# EAGLE schematic axiom_beta_interface_cmv12000_v0.3 (EAGLE 7.0.0)

## Sheet 1 of 2
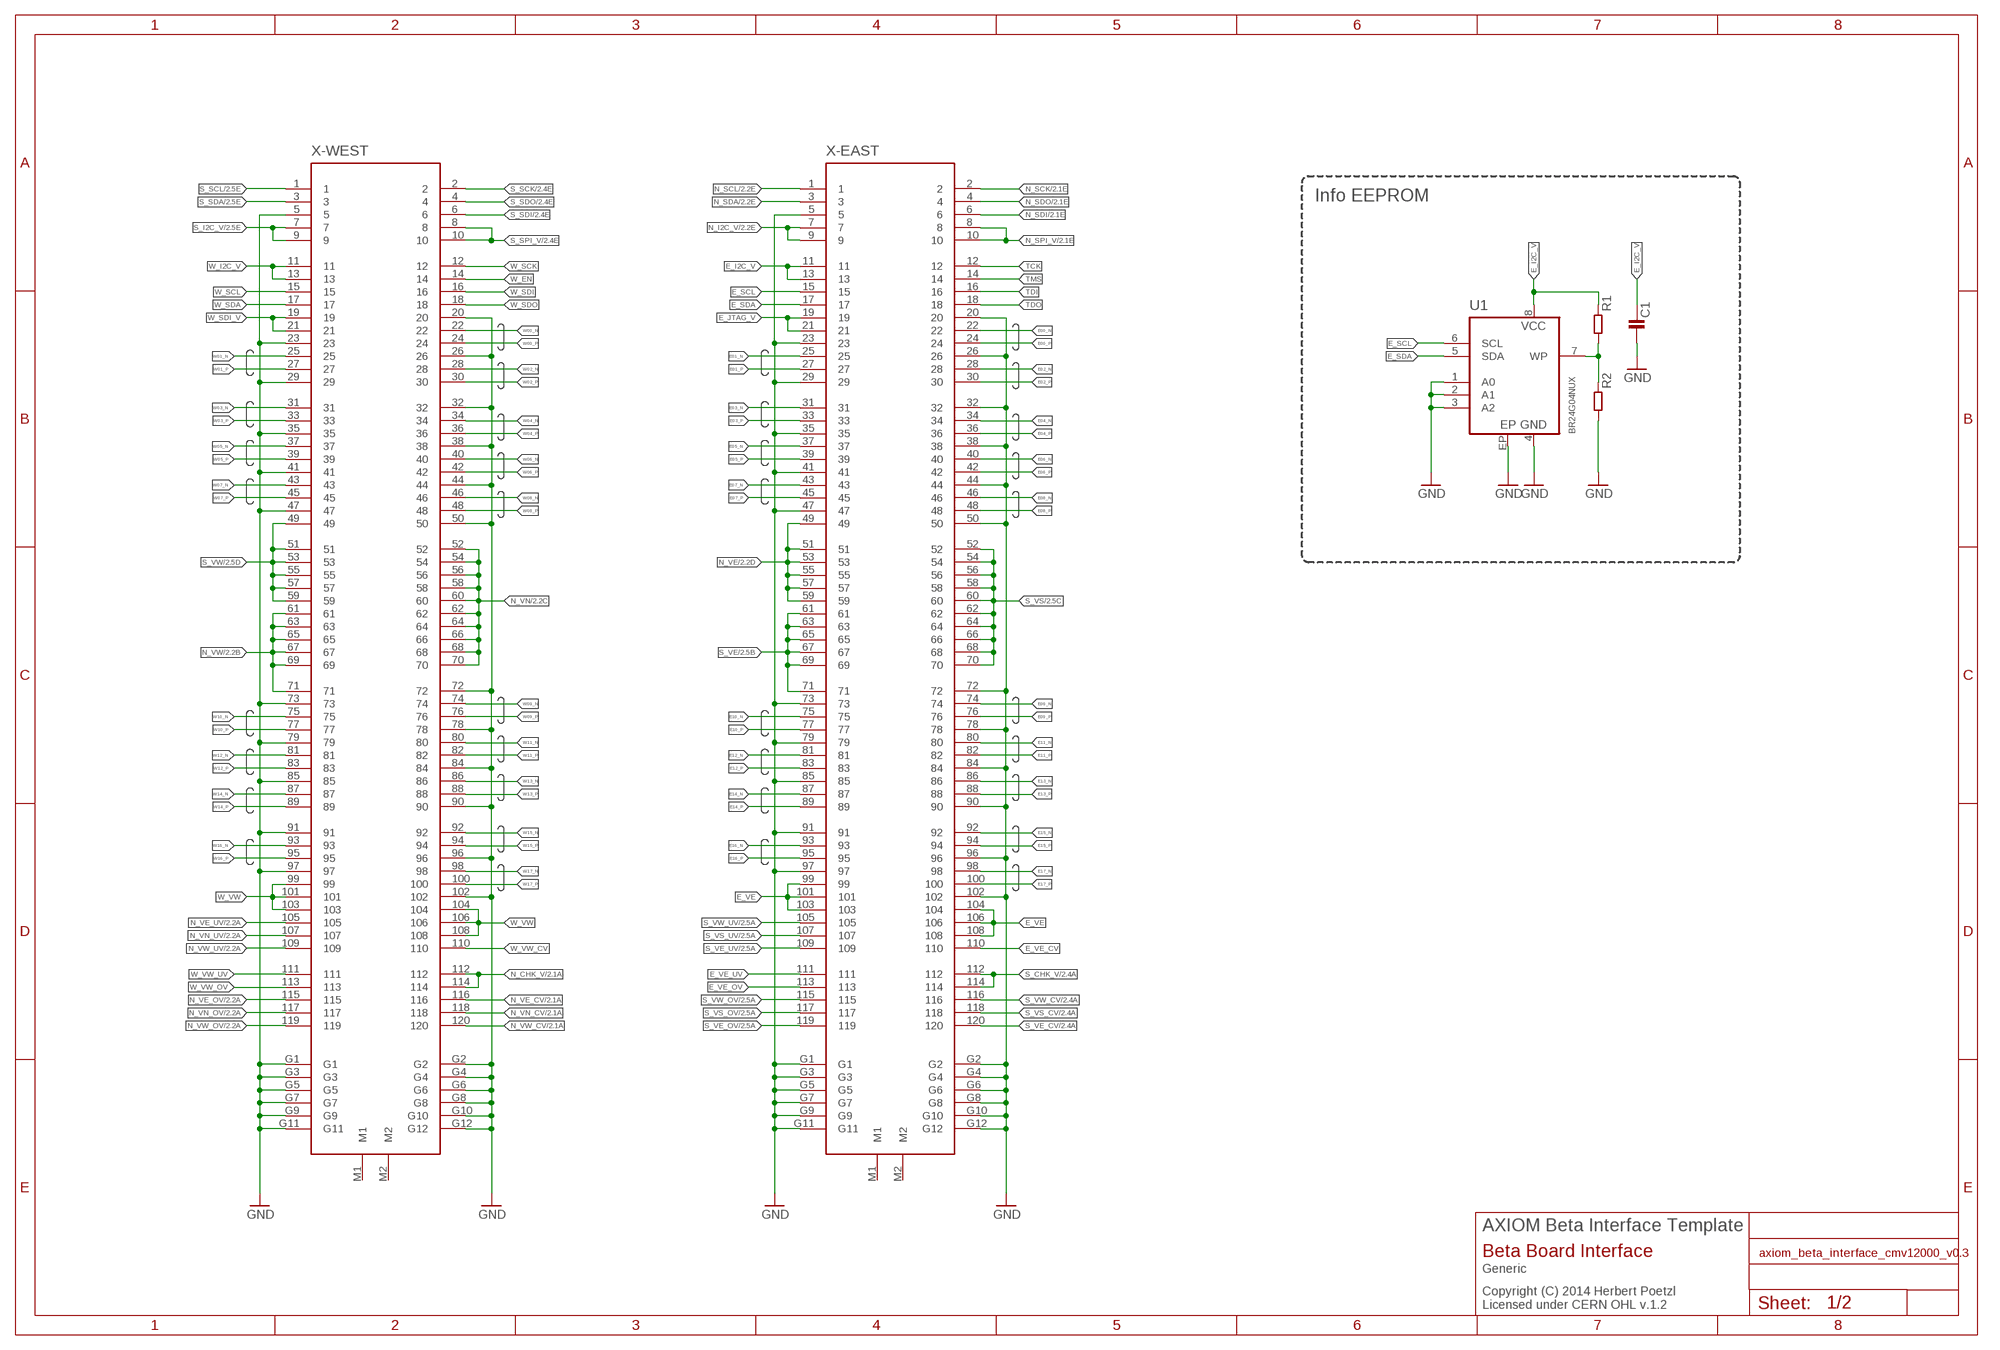
[diagram p0: schematic, sheet 1]

### Parts
C1  C0402-B  [0402-B]
R1  R0402-B  [0402-B]
R2  R0402-B  [0402-B]
U1  BR24G04NUX  [DFN200X300X100-9N]
X-EAST  FX10-120/12P  [FX10A-120P/12]
X-WEST  FX10-120/12P  [FX10A-120P/12]

### Nets
E00_N: X-EAST.22
E00_P: X-EAST.24
E01_N: X-EAST.25
E01_P: X-EAST.27
E02_N: X-EAST.28
E02_P: X-EAST.30
E03_N: X-EAST.31
E03_P: X-EAST.33
E04_N: X-EAST.34
E04_P: X-EAST.36
E05_N: X-EAST.37
E05_P: X-EAST.39
E06_N: X-EAST.40
E06_P: X-EAST.42
E07_N: X-EAST.43
E07_P: X-EAST.45
E08_N: X-EAST.46
E08_P: X-EAST.48
E09_N: X-EAST.74
E09_P: X-EAST.76
E10_N: X-EAST.75
E10_P: X-EAST.77
E11_N: X-EAST.80
E11_P: X-EAST.82
E12_N: X-EAST.81
E12_P: X-EAST.83
E13_N: X-EAST.86
E13_P: X-EAST.88
E14_N: X-EAST.87
E14_P: X-EAST.89
E15_N: X-EAST.92
E15_P: X-EAST.94
E16_N: X-EAST.93
E16_P: X-EAST.95
E17_N: X-EAST.98
E17_P: X-EAST.100
E_I2C_V: C1.1 R1.1 U1.8(VCC) X-EAST.11 X-EAST.13
E_JTAG_V: X-EAST.19 X-EAST.21
E_SCL: U1.6(SCL) X-EAST.15
E_SDA: U1.5(SDA) X-EAST.17
E_VE: X-EAST.99 X-EAST.101 X-EAST.103 X-EAST.104 X-EAST.106 X-EAST.108
E_VE_CV: X-EAST.110
E_VE_OV: X-EAST.113
E_VE_UV: X-EAST.111
GND [power]: C1.2 R2.2 U1.1(A0) U1.2(A1) U1.3(A2) U1.4(GND) U1.EP X-EAST.5 X-EAST.20 X-EAST.23 X-EAST.26 X-EAST.29 X-EAST.32 X-EAST.35 X-EAST.38 X-EAST.41 X-EAST.44 X-EAST.47 X-EAST.50 X-EAST.72 X-EAST.73 X-EAST.78 X-EAST.79 X-EAST.84 X-EAST.85 X-EAST.90 X-EAST.91 X-EAST.96 X-EAST.97 X-EAST.102 X-EAST.G1 X-EAST.G2 X-EAST.G3 X-EAST.G4 X-EAST.G5 X-EAST.G6 X-EAST.G7 X-EAST.G8 X-EAST.G9 X-EAST.G10 X-EAST.G11 X-EAST.G12 X-WEST.5 X-WEST.20 X-WEST.23 X-WEST.26 X-WEST.29 X-WEST.32 X-WEST.35 X-WEST.38 X-WEST.41 X-WEST.44 X-WEST.47 X-WEST.50 X-WEST.72 X-WEST.73 X-WEST.78 X-WEST.79 X-WEST.84 X-WEST.85 X-WEST.90 X-WEST.91 X-WEST.96 X-WEST.97 X-WEST.102 X-WEST.G1 X-WEST.G2 X-WEST.G3 X-WEST.G4 X-WEST.G5 X-WEST.G6 X-WEST.G7 X-WEST.G8 X-WEST.G9 X-WEST.G10 X-WEST.G11 X-WEST.G12 ; also sheet 2
N$12: R1.2 R2.1 U1.7(WP)
N_CHK_V: X-WEST.112 X-WEST.114 ; also sheet 2
N_I2C_V: X-EAST.7 X-EAST.9 ; also sheet 2
N_SCK: X-EAST.2 ; also sheet 2
N_SCL: X-EAST.1 ; also sheet 2
N_SDA: X-EAST.3 ; also sheet 2
N_SDI: X-EAST.6 ; also sheet 2
N_SDO: X-EAST.4 ; also sheet 2
N_SPI_V: X-EAST.8 X-EAST.10 ; also sheet 2
N_VE [power]: X-EAST.49 X-EAST.51 X-EAST.53 X-EAST.55 X-EAST.57 X-EAST.59 ; also sheet 2
N_VE_CV: X-WEST.116 ; also sheet 2
N_VE_OV: X-WEST.115 ; also sheet 2
N_VE_UV: X-WEST.105 ; also sheet 2
N_VN [power]: X-WEST.52 X-WEST.54 X-WEST.56 X-WEST.58 X-WEST.60 X-WEST.62 X-WEST.64 X-WEST.66 X-WEST.68 X-WEST.70 ; also sheet 2
N_VN_CV: X-WEST.118 ; also sheet 2
N_VN_OV: X-WEST.117 ; also sheet 2
N_VN_UV: X-WEST.107 ; also sheet 2
N_VW [power]: X-WEST.61 X-WEST.63 X-WEST.65 X-WEST.67 X-WEST.69 X-WEST.71 ; also sheet 2
N_VW_CV: X-WEST.120 ; also sheet 2
N_VW_OV: X-WEST.119 ; also sheet 2
N_VW_UV: X-WEST.109 ; also sheet 2
S_CHK_V: X-EAST.112 X-EAST.114 ; also sheet 2
S_I2C_V: X-WEST.7 X-WEST.9 ; also sheet 2
S_SCK: X-WEST.2 ; also sheet 2
S_SCL: X-WEST.1 ; also sheet 2
S_SDA: X-WEST.3 ; also sheet 2
S_SDI: X-WEST.6 ; also sheet 2
S_SDO: X-WEST.4 ; also sheet 2
S_SPI_V: X-WEST.8 X-WEST.10 ; also sheet 2
S_VE [power]: X-EAST.61 X-EAST.63 X-EAST.65 X-EAST.67 X-EAST.69 X-EAST.71 ; also sheet 2
S_VE_CV: X-EAST.120 ; also sheet 2
S_VE_OV: X-EAST.119 ; also sheet 2
S_VE_UV: X-EAST.109 ; also sheet 2
S_VS [power]: X-EAST.52 X-EAST.54 X-EAST.56 X-EAST.58 X-EAST.60 X-EAST.62 X-EAST.64 X-EAST.66 X-EAST.68 X-EAST.70 ; also sheet 2
S_VS_CV: X-EAST.118 ; also sheet 2
S_VS_OV: X-EAST.117 ; also sheet 2
S_VS_UV: X-EAST.107 ; also sheet 2
S_VW [power]: X-WEST.49 X-WEST.51 X-WEST.53 X-WEST.55 X-WEST.57 X-WEST.59 ; also sheet 2
S_VW_CV: X-EAST.116 ; also sheet 2
S_VW_OV: X-EAST.115 ; also sheet 2
S_VW_UV: X-EAST.105 ; also sheet 2
TCK: X-EAST.12
TDI: X-EAST.16
TDO: X-EAST.18
TMS: X-EAST.14
W00_N: X-WEST.22
W00_P: X-WEST.24
W01_N: X-WEST.25
W01_P: X-WEST.27
W02_N: X-WEST.28
W02_P: X-WEST.30
W03_N: X-WEST.31
W03_P: X-WEST.33
W04_N: X-WEST.34
W04_P: X-WEST.36
W05_N: X-WEST.37
W05_P: X-WEST.39
W06_N: X-WEST.40
W06_P: X-WEST.42
W07_N: X-WEST.43
W07_P: X-WEST.45
W08_N: X-WEST.46
W08_P: X-WEST.48
W09_N: X-WEST.74
W09_P: X-WEST.76
W10_N: X-WEST.75
W10_P: X-WEST.77
W11_N: X-WEST.80
W11_P: X-WEST.82
W12_N: X-WEST.81
W12_P: X-WEST.83
W13_N: X-WEST.86
W13_P: X-WEST.88
W14_N: X-WEST.87
W14_P: X-WEST.89
W15_N: X-WEST.92
W15_P: X-WEST.94
W16_N: X-WEST.93
W16_P: X-WEST.95
W17_N: X-WEST.98
W17_P: X-WEST.100
W_EN: X-WEST.14
W_I2C_V: X-WEST.11 X-WEST.13
W_SCK: X-WEST.12
W_SCL: X-WEST.15
W_SDA: X-WEST.17
W_SDI: X-WEST.16
W_SDI_V: X-WEST.19 X-WEST.21
W_SDO: X-WEST.18
W_VW: X-WEST.99 X-WEST.101 X-WEST.103 X-WEST.104 X-WEST.106 X-WEST.108
W_VW_CV: X-WEST.110
W_VW_OV: X-WEST.113
W_VW_UV: X-WEST.111
Unconnected: X-EAST.M1 X-EAST.M2 X-WEST.M1 X-WEST.M2

### Notes on the sheet
- Info EEPROM
- AXIOM Beta Interface Template
- Beta Board Interface
- Generic
- Copyright (C) 2014 Herbert Poetzl
  Licensed under CERN OHL v.1.2

## Sheet 2 of 2
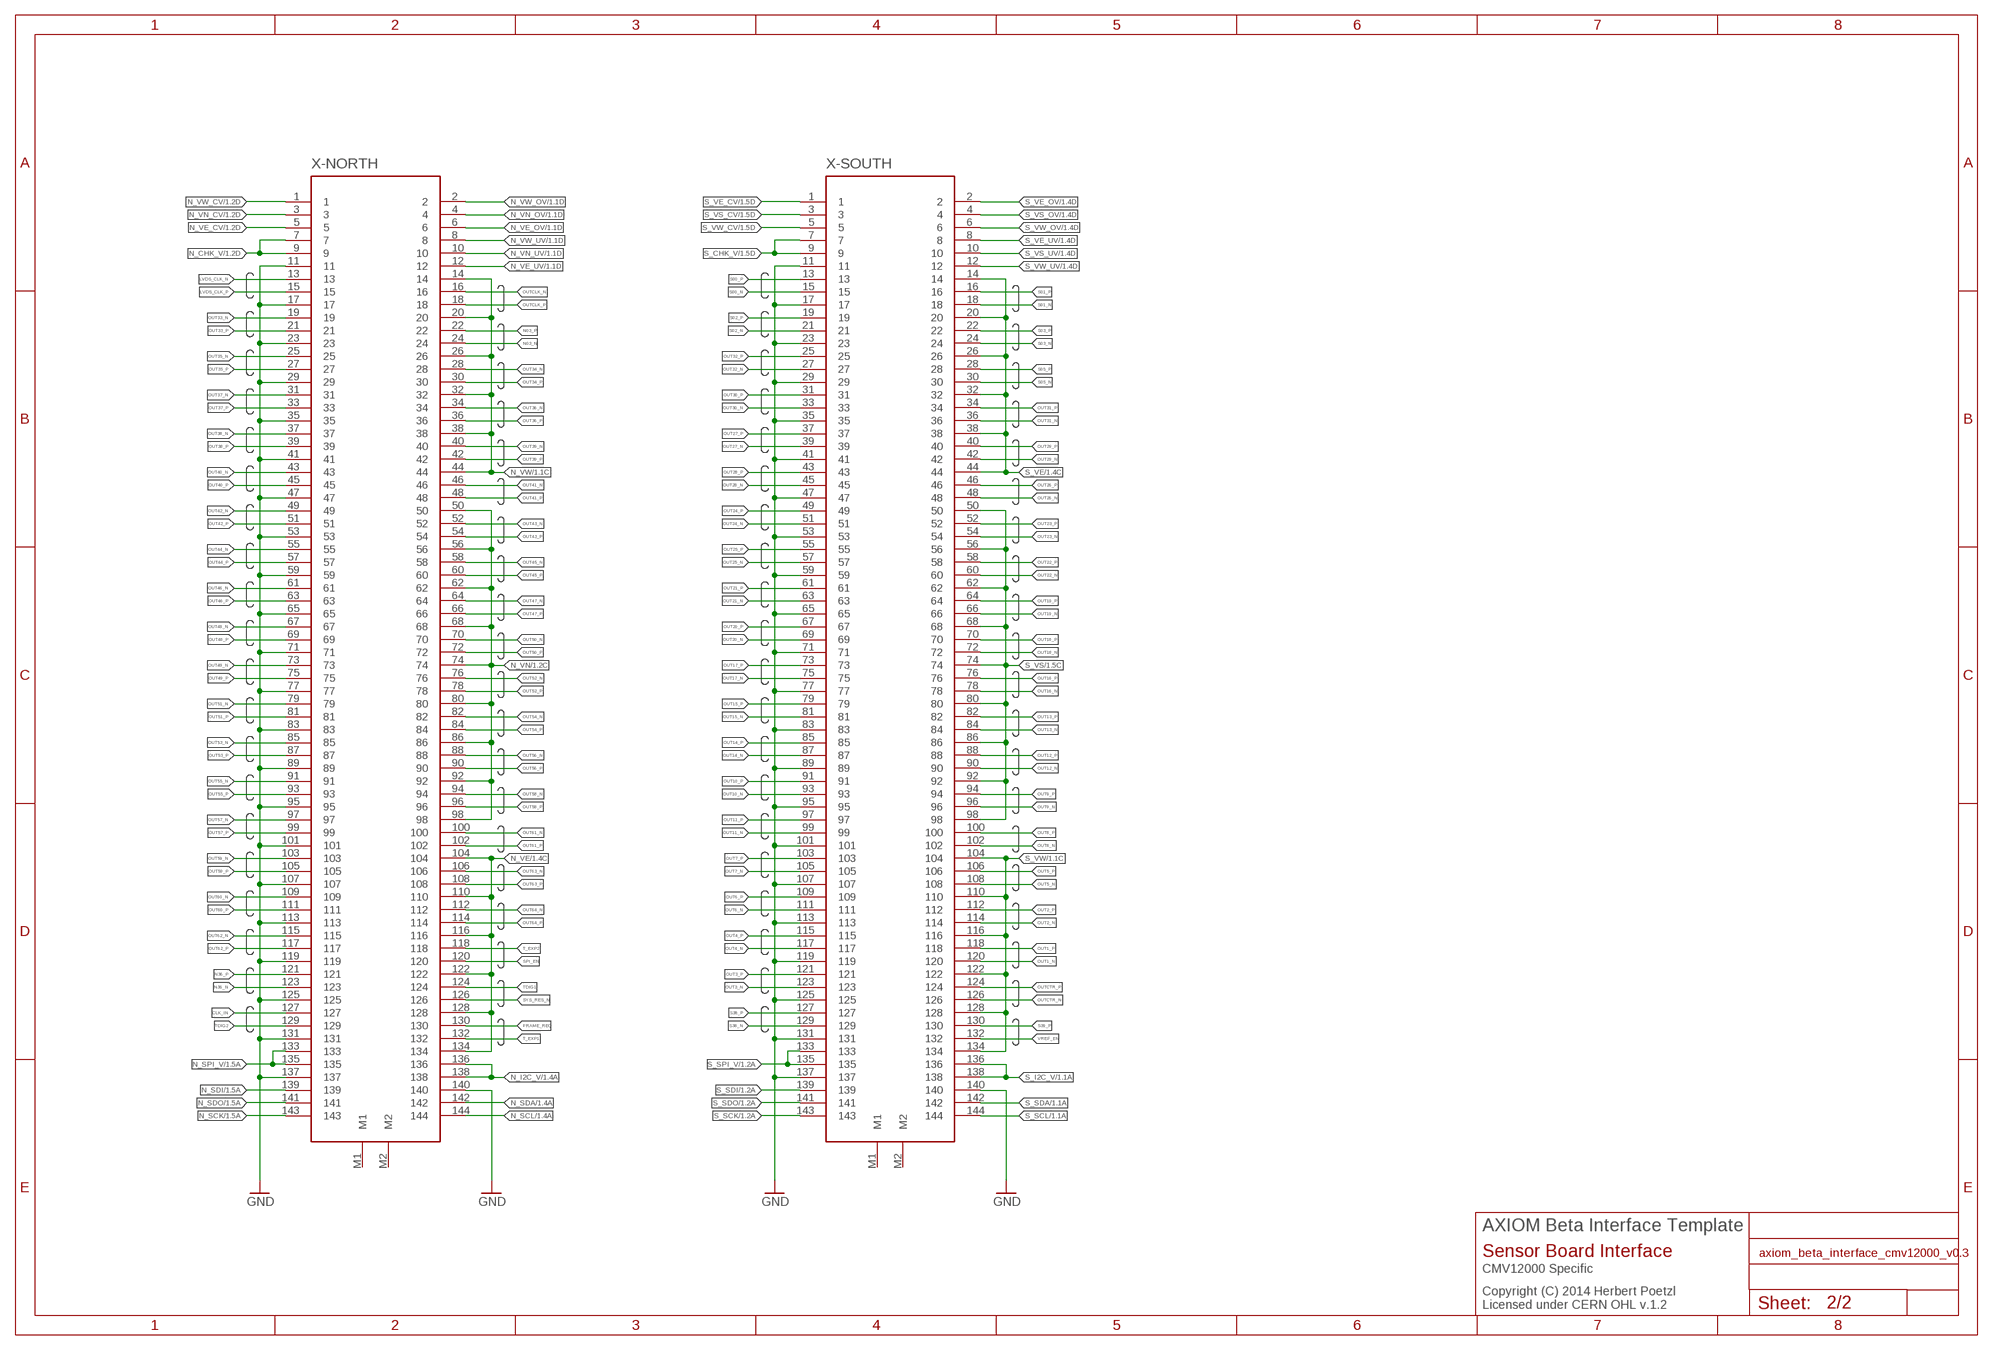
[diagram p1: schematic, sheet 2]

### Parts
X-NORTH  FX10-144S  [FX10A-144S]
X-SOUTH  FX10-144S  [FX10A-144S]

### Nets
CLK_IN: X-NORTH.127
FRAME_REQ: X-NORTH.130
GND [power]: X-NORTH.11 X-NORTH.17 X-NORTH.23 X-NORTH.29 X-NORTH.35 X-NORTH.41 X-NORTH.47 X-NORTH.53 X-NORTH.59 X-NORTH.65 X-NORTH.71 X-NORTH.77 X-NORTH.83 X-NORTH.89 X-NORTH.95 X-NORTH.101 X-NORTH.107 X-NORTH.113 X-NORTH.119 X-NORTH.125 X-NORTH.131 X-NORTH.137 X-NORTH.140 X-SOUTH.11 X-SOUTH.17 X-SOUTH.23 X-SOUTH.29 X-SOUTH.35 X-SOUTH.41 X-SOUTH.47 X-SOUTH.53 X-SOUTH.59 X-SOUTH.65 X-SOUTH.71 X-SOUTH.77 X-SOUTH.83 X-SOUTH.89 X-SOUTH.95 X-SOUTH.101 X-SOUTH.107 X-SOUTH.113 X-SOUTH.119 X-SOUTH.125 X-SOUTH.131 X-SOUTH.137 X-SOUTH.140 ; also sheet 1
LVDS_CLK_N: X-NORTH.13
LVDS_CLK_P: X-NORTH.15
N03_N: X-NORTH.24
N03_P: X-NORTH.22
N36_N: X-NORTH.123
N36_P: X-NORTH.121
N_CHK_V: X-NORTH.7 X-NORTH.9 ; also sheet 1
N_I2C_V: X-NORTH.136 X-NORTH.138 ; also sheet 1
N_SCK: X-NORTH.143 ; also sheet 1
N_SCL: X-NORTH.144 ; also sheet 1
N_SDA: X-NORTH.142 ; also sheet 1
N_SDI: X-NORTH.139 ; also sheet 1
N_SDO: X-NORTH.141 ; also sheet 1
N_SPI_V: X-NORTH.133 X-NORTH.135 ; also sheet 1
N_VE [power]: X-NORTH.104 X-NORTH.110 X-NORTH.116 X-NORTH.122 X-NORTH.128 X-NORTH.134 ; also sheet 1
N_VE_CV: X-NORTH.5 ; also sheet 1
N_VE_OV: X-NORTH.6 ; also sheet 1
N_VE_UV: X-NORTH.12 ; also sheet 1
N_VN [power]: X-NORTH.50 X-NORTH.56 X-NORTH.62 X-NORTH.68 X-NORTH.74 X-NORTH.80 X-NORTH.86 X-NORTH.92 X-NORTH.98 ; also sheet 1
N_VN_CV: X-NORTH.3 ; also sheet 1
N_VN_OV: X-NORTH.4 ; also sheet 1
N_VN_UV: X-NORTH.10 ; also sheet 1
N_VW [power]: X-NORTH.14 X-NORTH.20 X-NORTH.26 X-NORTH.32 X-NORTH.38 X-NORTH.44 ; also sheet 1
N_VW_CV: X-NORTH.1 ; also sheet 1
N_VW_OV: X-NORTH.2 ; also sheet 1
N_VW_UV: X-NORTH.8 ; also sheet 1
OUT1_N: X-SOUTH.120
OUT1_P: X-SOUTH.118
OUT2_N: X-SOUTH.114
OUT2_P: X-SOUTH.112
OUT3_N: X-SOUTH.123
OUT3_P: X-SOUTH.121
OUT4_N: X-SOUTH.117
OUT4_P: X-SOUTH.115
OUT5_N: X-SOUTH.108
OUT5_P: X-SOUTH.106
OUT6_N: X-SOUTH.111
OUT6_P: X-SOUTH.109
OUT7_N: X-SOUTH.105
OUT7_P: X-SOUTH.103
OUT8_N: X-SOUTH.102
OUT8_P: X-SOUTH.100
OUT9_N: X-SOUTH.96
OUT9_P: X-SOUTH.94
OUT10_N: X-SOUTH.93
OUT10_P: X-SOUTH.91
OUT11_N: X-SOUTH.99
OUT11_P: X-SOUTH.97
OUT12_N: X-SOUTH.90
OUT12_P: X-SOUTH.88
OUT13_N: X-SOUTH.84
OUT13_P: X-SOUTH.82
OUT14_N: X-SOUTH.87
OUT14_P: X-SOUTH.85
OUT15_N: X-SOUTH.81
OUT15_P: X-SOUTH.79
OUT16_N: X-SOUTH.78
OUT16_P: X-SOUTH.76
OUT17_N: X-SOUTH.75
OUT17_P: X-SOUTH.73
OUT18_N: X-SOUTH.72
OUT18_P: X-SOUTH.70
OUT19_N: X-SOUTH.66
OUT19_P: X-SOUTH.64
OUT20_N: X-SOUTH.69
OUT20_P: X-SOUTH.67
OUT21_N: X-SOUTH.63
OUT21_P: X-SOUTH.61
OUT22_N: X-SOUTH.60
OUT22_P: X-SOUTH.58
OUT23_N: X-SOUTH.54
OUT23_P: X-SOUTH.52
OUT24_N: X-SOUTH.51
OUT24_P: X-SOUTH.49
OUT25_N: X-SOUTH.57
OUT25_P: X-SOUTH.55
OUT26_N: X-SOUTH.48
OUT26_P: X-SOUTH.46
OUT27_N: X-SOUTH.39
OUT27_P: X-SOUTH.37
OUT28_N: X-SOUTH.45
OUT28_P: X-SOUTH.43
OUT29_N: X-SOUTH.42
OUT29_P: X-SOUTH.40
OUT30_N: X-SOUTH.33
OUT30_P: X-SOUTH.31
OUT31_N: X-SOUTH.36
OUT31_P: X-SOUTH.34
OUT32_N: X-SOUTH.27
OUT32_P: X-SOUTH.25
OUT33_N: X-NORTH.19
OUT33_P: X-NORTH.21
OUT34_N: X-NORTH.28
OUT34_P: X-NORTH.30
OUT35_N: X-NORTH.25
OUT35_P: X-NORTH.27
OUT36_N: X-NORTH.34
OUT36_P: X-NORTH.36
OUT37_N: X-NORTH.31
OUT37_P: X-NORTH.33
OUT38_N: X-NORTH.37
OUT38_P: X-NORTH.39
OUT39_N: X-NORTH.40
OUT39_P: X-NORTH.42
OUT40_N: X-NORTH.43
OUT40_P: X-NORTH.45
OUT41_N: X-NORTH.46
OUT41_P: X-NORTH.48
OUT42_N: X-NORTH.49
OUT42_P: X-NORTH.51
OUT43_N: X-NORTH.52
OUT43_P: X-NORTH.54
OUT44_N: X-NORTH.55
OUT44_P: X-NORTH.57
OUT45_N: X-NORTH.58
OUT45_P: X-NORTH.60
OUT46_N: X-NORTH.61
OUT46_P: X-NORTH.63
OUT47_N: X-NORTH.64
OUT47_P: X-NORTH.66
OUT48_N: X-NORTH.67
OUT48_P: X-NORTH.69
OUT49_N: X-NORTH.73
OUT49_P: X-NORTH.75
OUT50_N: X-NORTH.70
OUT50_P: X-NORTH.72
OUT51_N: X-NORTH.79
OUT51_P: X-NORTH.81
OUT52_N: X-NORTH.76
OUT52_P: X-NORTH.78
OUT53_N: X-NORTH.85
OUT53_P: X-NORTH.87
OUT54_N: X-NORTH.82
OUT54_P: X-NORTH.84
OUT55_N: X-NORTH.91
OUT55_P: X-NORTH.93
OUT56_N: X-NORTH.88
OUT56_P: X-NORTH.90
OUT57_N: X-NORTH.97
OUT57_P: X-NORTH.99
OUT58_N: X-NORTH.94
OUT58_P: X-NORTH.96
OUT59_N: X-NORTH.103
OUT59_P: X-NORTH.105
OUT60_N: X-NORTH.109
OUT60_P: X-NORTH.111
OUT61_N: X-NORTH.100
OUT61_P: X-NORTH.102
OUT62_N: X-NORTH.115
OUT62_P: X-NORTH.117
OUT63_N: X-NORTH.106
OUT63_P: X-NORTH.108
OUT64_N: X-NORTH.112
OUT64_P: X-NORTH.114
OUTCLK_N: X-NORTH.16
OUTCLK_P: X-NORTH.18
OUTCTR_N: X-SOUTH.126
OUTCTR_P: X-SOUTH.124
S00_N: X-SOUTH.15
S00_P: X-SOUTH.13
S01_N: X-SOUTH.18
S01_P: X-SOUTH.16
S02_N: X-SOUTH.21
S02_P: X-SOUTH.19
S03_N: X-SOUTH.24
S03_P: X-SOUTH.22
S05_N: X-SOUTH.30
S05_P: X-SOUTH.28
S38_N: X-SOUTH.129
S38_P: X-SOUTH.127
S39_P: X-SOUTH.130
S_CHK_V: X-SOUTH.7 X-SOUTH.9 ; also sheet 1
S_I2C_V: X-SOUTH.136 X-SOUTH.138 ; also sheet 1
S_SCK: X-SOUTH.143 ; also sheet 1
S_SCL: X-SOUTH.144 ; also sheet 1
S_SDA: X-SOUTH.142 ; also sheet 1
S_SDI: X-SOUTH.139 ; also sheet 1
S_SDO: X-SOUTH.141 ; also sheet 1
S_SPI_V: X-SOUTH.133 X-SOUTH.135 ; also sheet 1
S_VE [power]: X-SOUTH.14 X-SOUTH.20 X-SOUTH.26 X-SOUTH.32 X-SOUTH.38 X-SOUTH.44 ; also sheet 1
S_VE_CV: X-SOUTH.1 ; also sheet 1
S_VE_OV: X-SOUTH.2 ; also sheet 1
S_VE_UV: X-SOUTH.8 ; also sheet 1
S_VS [power]: X-SOUTH.50 X-SOUTH.56 X-SOUTH.62 X-SOUTH.68 X-SOUTH.74 X-SOUTH.80 X-SOUTH.86 X-SOUTH.92 X-SOUTH.98 ; also sheet 1
S_VS_CV: X-SOUTH.3 ; also sheet 1
S_VS_OV: X-SOUTH.4 ; also sheet 1
S_VS_UV: X-SOUTH.10 ; also sheet 1
S_VW [power]: X-SOUTH.104 X-SOUTH.110 X-SOUTH.116 X-SOUTH.122 X-SOUTH.128 X-SOUTH.134 ; also sheet 1
S_VW_CV: X-SOUTH.5 ; also sheet 1
S_VW_OV: X-SOUTH.6 ; also sheet 1
S_VW_UV: X-SOUTH.12 ; also sheet 1
SPI_EN: X-NORTH.120
SYS_RES_N: X-NORTH.126
T_EXP1: X-NORTH.132
T_EXP2: X-NORTH.118
TDIG1: X-NORTH.124
TDIG2: X-NORTH.129
VREF_EN: X-SOUTH.132
Unconnected: X-NORTH.M1 X-NORTH.M2 X-SOUTH.M1 X-SOUTH.M2

### Notes on the sheet
- AXIOM Beta Interface Template
- Sensor Board Interface
- CMV12000 Specific
- Copyright (C) 2014 Herbert Poetzl
  Licensed under CERN OHL v.1.2

## Library data of the parts
C1 = generic-rcl:C
R1 R2 = generic-rcl:R
U1 = eeprom:BR24G04
X-EAST X-WEST = fx10:FX10-120/12
X-NORTH X-SOUTH = fx10:FX10-144

## Net classes
0 default: width 0.152 mm, drill 0.254 mm
1 power: width 0.152 mm, drill 0.254 mm